# EasyEDA schematic digital clock no res.json
TITLE: Digital Clock Schematics; REV: 1.0; Date: 2021-03-11; Sheet: 1/1; Drawn By: QueenOfTheNorth; Company: Your Company
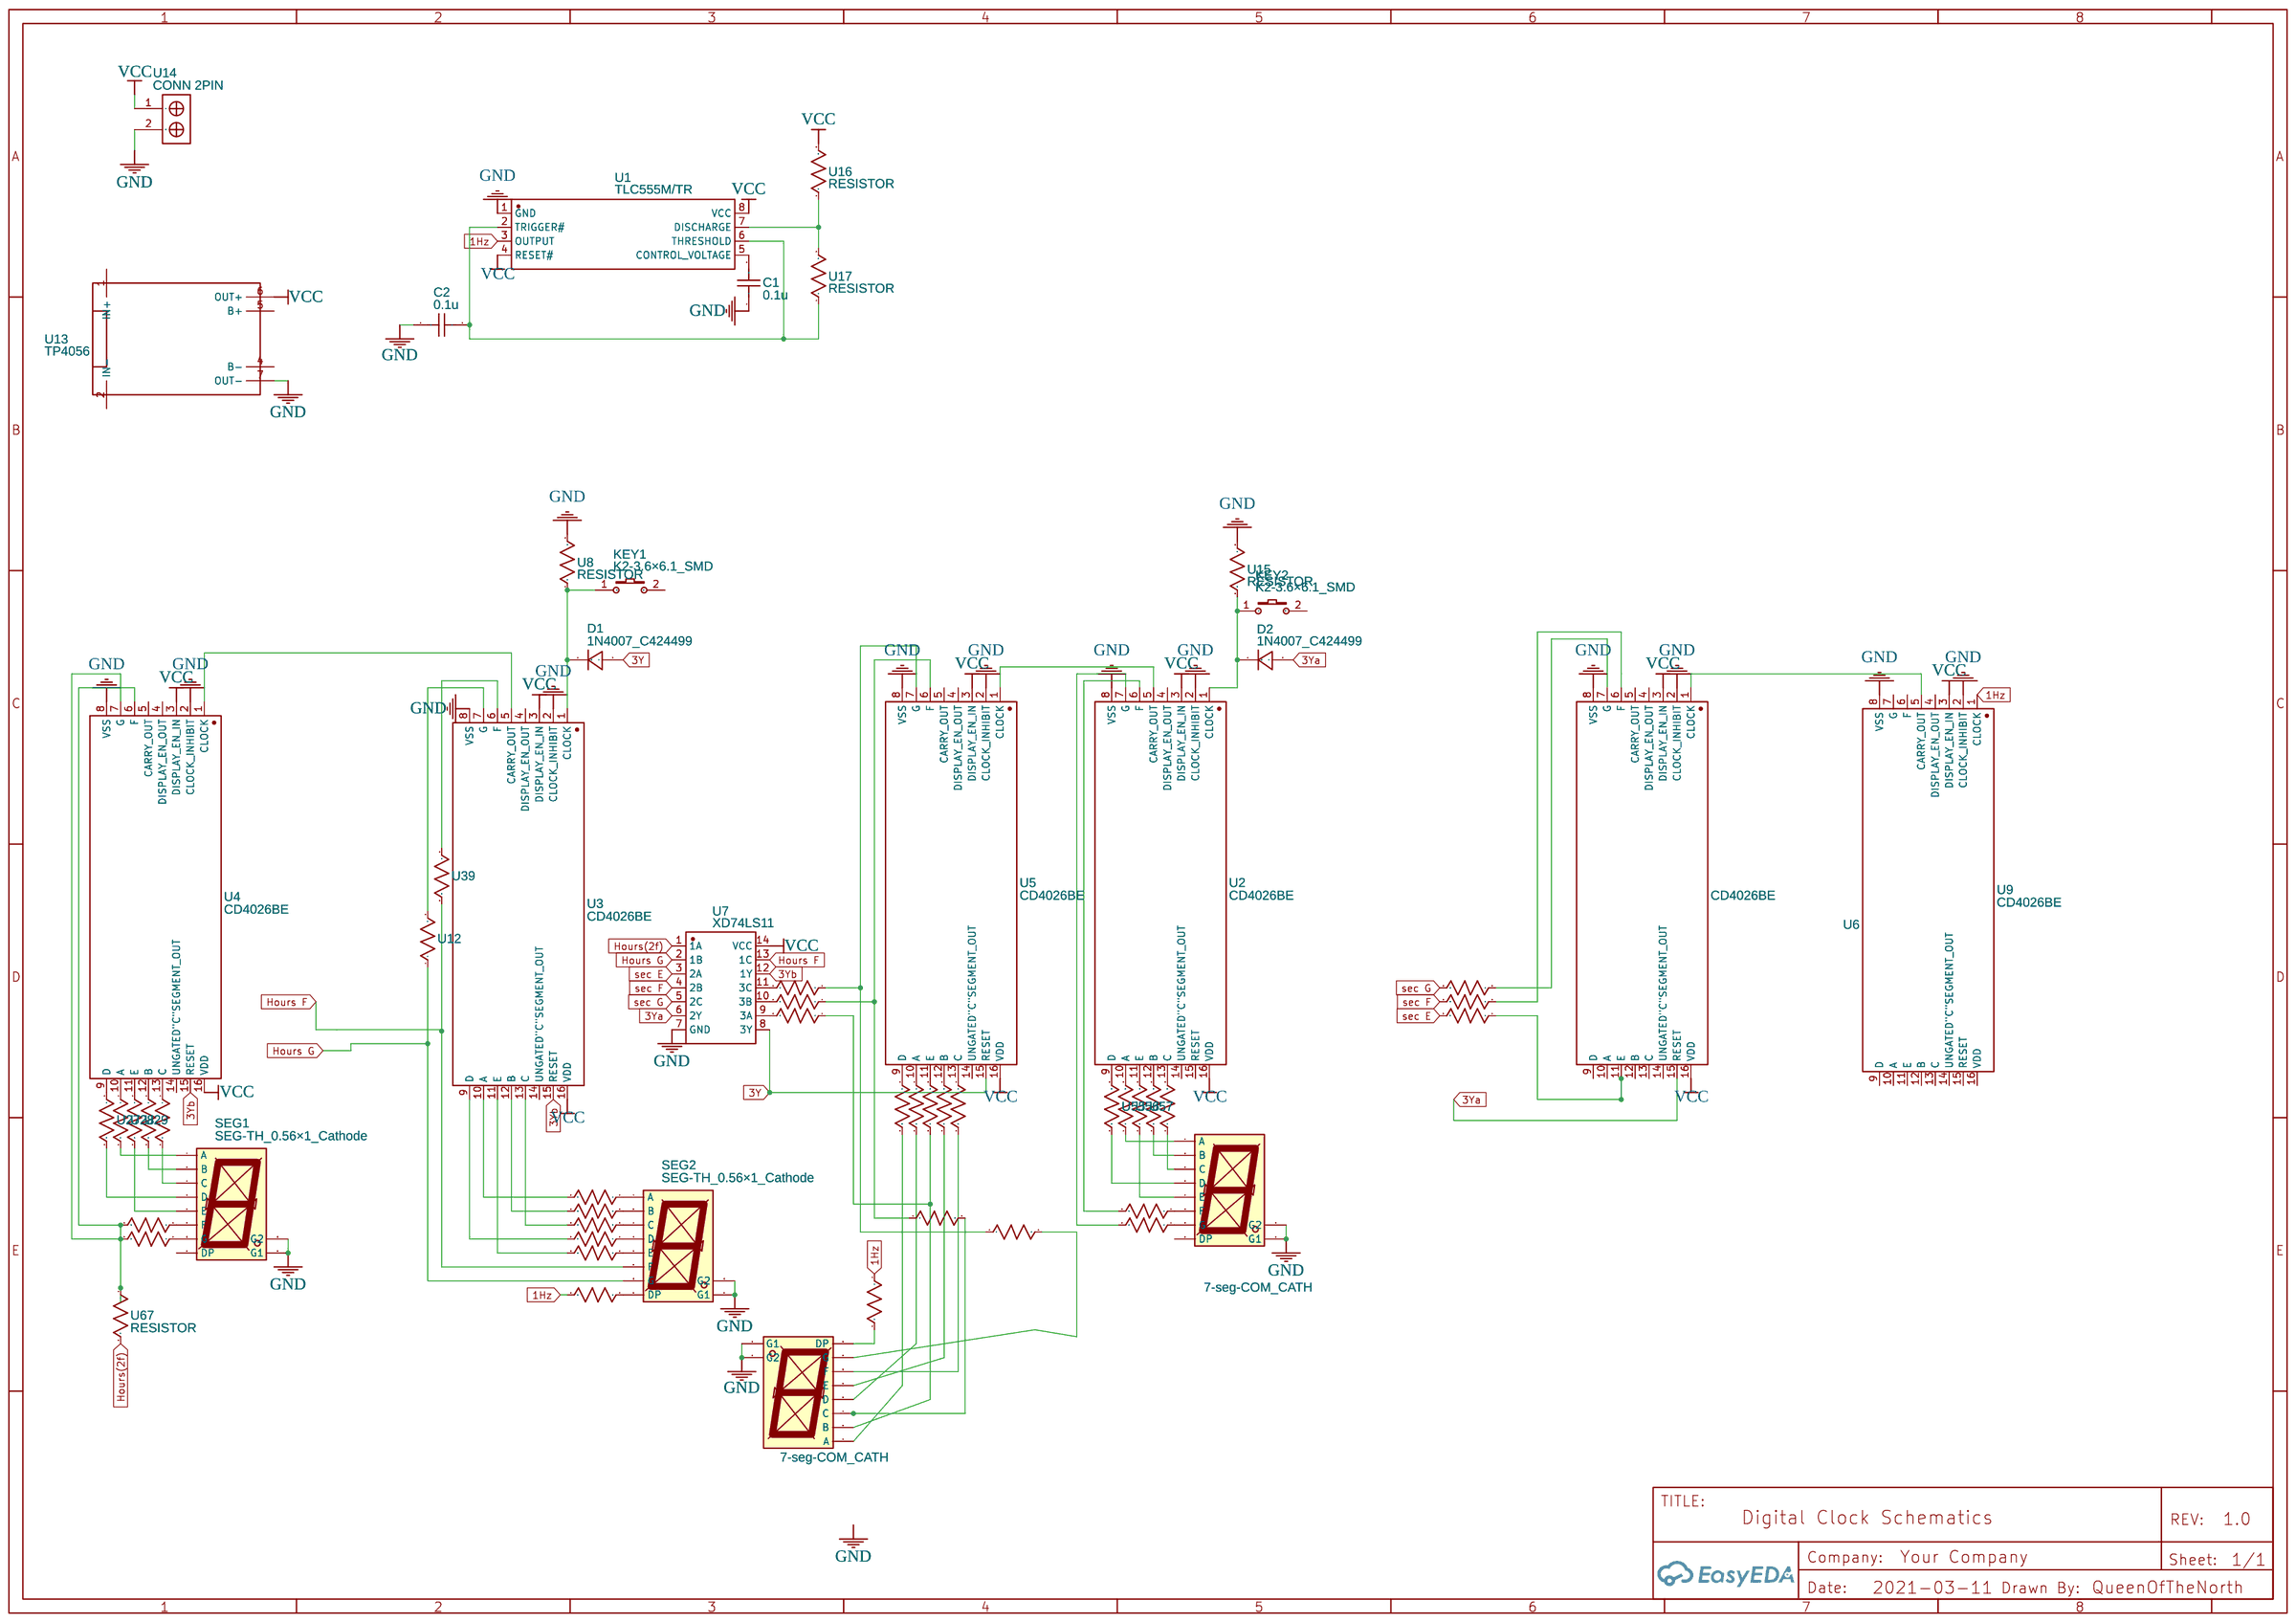
[diagram p0: schematic sheet]

## Parts
C1  0.1u  [C0603]
C2  0.1u  [C0603]
D1  1N4007_C424499  [DO-41_BD2.4-L4.7-P8.70-D0.9-RD]
D2  1N4007_C424499  [DO-41_BD2.4-L4.7-P8.70-D0.9-RD]
KEY1  K2-3.6×6.1_SMD  [KEY-SMD_2P-L6.2-W3.6-LS8.0]
KEY2  K2-3.6×6.1_SMD  [KEY-SMD_2P-L6.2-W3.6-LS8.0]
SEG1  SEG-TH_0.56×1_Cathode  [LED-SEG-TH_10P-L12.6-W19.0-P2.54-S15.24-BL]
SEG2  SEG-TH_0.56×1_Cathode  [LED-SEG-TH_10P-L12.6-W19.0-P2.54-S15.24-BL]
SEG3  7-seg-COM_CATH  [LED-SEG-TH_10P-L12.6-W19.0-P2.54-S15.24-BL]
SEG4  7-seg-COM_CATH  [LED-SEG-TH_10P-L12.6-W19.0-P2.54-S15.24-BL]
U1  TLC555M/TR  [SOP-8_L4.9-W3.9-P1.27-LS6.0-BL]
U2  CD4026BE  [DIP-16_L20.3-W10.2-P2.54-LS10.2-BL]
U3  CD4026BE  [DIP-16_L20.3-W10.2-P2.54-LS10.2-BL]
U4  CD4026BE  [DIP-16_L20.3-W10.2-P2.54-LS10.2-BL]
U5  CD4026BE  [DIP-16_L20.3-W10.2-P2.54-LS10.2-BL]
U6  CD4026BE  [DIP-16_L20.3-W10.2-P2.54-LS10.2-BL]
U7  XD74LS11  [DIP-14_L19.4-W6.4-P2.54-LS7.6-BL]
U8  RESISTOR  [0.4W 1% RESISTOR]
U9  CD4026BE  [DIP-16_L20.3-W10.2-P2.54-LS10.2-BL]
U10  RESISTOR  [0.4W 1% RESISTOR]
U11  RESISTOR  [0.4W 1% RESISTOR]
U12  RESISTOR  [0.4W 1% RESISTOR]
U13  TP4056  [TP4056-PROTECT]
U14  CONN 2PIN  [TERMINAL_BLOCK_KF762-3P]
U15  RESISTOR  [0.4W 1% RESISTOR]
U16  RESISTOR  [0.4W 1% RESISTOR]
U17  RESISTOR  [0.4W 1% RESISTOR]
U18  RESISTOR  [0.4W 1% RESISTOR]
U19  RESISTOR  [0.4W 1% RESISTOR]
U20  RESISTOR  [0.4W 1% RESISTOR]
U21  RESISTOR  [0.4W 1% RESISTOR]
U22  RESISTOR  [0.4W 1% RESISTOR]
U25  RESISTOR  [0.4W 1% RESISTOR]
U26  RESISTOR  [0.4W 1% RESISTOR]
U27  RESISTOR  [0.4W 1% RESISTOR]
U28  RESISTOR  [0.4W 1% RESISTOR]
U29  RESISTOR  [0.4W 1% RESISTOR]
U30  RESISTOR  [0.4W 1% RESISTOR]
U31  RESISTOR  [0.4W 1% RESISTOR]
U32  RESISTOR  [0.4W 1% RESISTOR]
U33  RESISTOR  [0.4W 1% RESISTOR]
U34  RESISTOR  [0.4W 1% RESISTOR]
U35  RESISTOR  [0.4W 1% RESISTOR]
U36  RESISTOR  [0.4W 1% RESISTOR]
U37  RESISTOR  [0.4W 1% RESISTOR]
U38  RESISTOR  [0.4W 1% RESISTOR]
U39  RESISTOR  [0.4W 1% RESISTOR]
U52  RESISTOR  [0.4W 1% RESISTOR]
U53  RESISTOR  [0.4W 1% RESISTOR]
U54  RESISTOR  [0.4W 1% RESISTOR]
U55  RESISTOR  [0.4W 1% RESISTOR]
U56  RESISTOR  [0.4W 1% RESISTOR]
U57  RESISTOR  [0.4W 1% RESISTOR]
U58  RESISTOR  [0.4W 1% RESISTOR]
U59  RESISTOR  [0.4W 1% RESISTOR]
U60  RESISTOR  [0.4W 1% RESISTOR]
U61  RESISTOR  [0.4W 1% RESISTOR]
U62  RESISTOR  [0.4W 1% RESISTOR]
U63  RESISTOR  [0.4W 1% RESISTOR]
U64  RESISTOR  [0.4W 1% RESISTOR]
U67  RESISTOR  [0.4W 1% RESISTOR]

## Library data of the parts
C1 C2 = C_0603_US: Contributor: LCEDA_Lib
D1 D2 = 1N4007_C424499: Supplier: LCSC; Supplier Part: C424499; Manufacturer: SUNMATE Elec; Manufacturer Part: 1N4007; Contributor: LCSC; LCSC Assembly: Yes; SMT Type: Extend; Assembly Type: manualWeld; Paste Type: expand
KEY1 KEY2 = K2-3.6×6.1_SMD: Supplier Part: C118141; Supplier: LCSC; Manufacturer Part: K2-1107ST-A4SW-06; Contributor: LCEDA_Lib; 制造商: 韩国韩荣
SEG1-SEG4 = SEG-TH_0.56×1_Cathode: Manufacturer: 志浩; Supplier Part: C8093; Contributor: LCEDA_01
U1 = TLC555M/TR: Supplier: LCSC; Supplier Part: C383061; Manufacturer: HGSEMI; Contributor: LCSC; Assembly Type: smtWeld; Paste Type: expand
U2-U6 U9 = CD4026BE: Supplier: LCSC; Manufacturer: TI; Supplier Part: C89909; LCSC Assembly: Yes; SMT Type: Extend; Assembly Type: manualWeld; Paste Type: expand
U7 = XD74LS11: Supplier: LCSC; Supplier Part: C521167; Manufacturer: XINLUDA(信路达); Contributor: LCSC
U8 U10-U12 U15-U22 U25-U39 U52-U64 U67 = RESISTOR: Contributor: dannyjacket
U13 = TP4056: Manufacturer Part: TP4056-protect; link: https://dlnmh9ip6v2uc.cloudfront.net/datasheets/Prototyping/TP4056.pdf; Contributor: quocanhhai
U14 = CONN 2PIN: Manufacturer Part: Terminal Block; Supplier Part: undefined; Contributor: bangnaga

## Nets
GND: C1.1 C2.1 SEG1.3(G1) SEG1.8(G2) SEG2.3(G1) SEG2.8(G2) SEG3.3(G1) SEG3.8(G2) SEG4.3(G1) SEG4.8(G2) U1.1(GND) U2.2(CLOCK_INHIBIT) U2.8(VSS) U3.2(CLOCK_INHIBIT) U3.8(VSS) U4.2(CLOCK_INHIBIT) U4.8(VSS) U5.2(CLOCK_INHIBIT) U5.8(VSS) U6.2(CLOCK_INHIBIT) U6.8(VSS) U7.7(GND) U8.2 U9.2(CLOCK_INHIBIT) U9.8(VSS) U13.7(OUT-) U14.2 U15.2
VCC: U1.4(RESET#) U1.8(VCC) U2.3(DISPLAY_EN_IN) U2.16(VDD) U3.3(DISPLAY_EN_IN) U3.16(VDD) U4.3(DISPLAY_EN_IN) U4.16(VDD) U5.3(DISPLAY_EN_IN) U5.16(VDD) U6.3(DISPLAY_EN_IN) U6.16(VDD) U7.14(VCC) U9.3(DISPLAY_EN_IN) U13.6(OUT+) U14.1 U16.2
1Hz: U1.3(OUTPUT) U9.1(CLOCK) U10.1 U11.2
3Y: D1.2(A) U5.15(RESET) U7.8(3Y)
3Ya: D2.2(A) U6.15(RESET) U7.6(2Y)
3Yb: U3.15(RESET) U4.15(RESET) U7.12(1Y)
Hours F: SEG2.9(F) U7.13(1C) U39.1
Hours G: SEG2.10(G) U7.2(1B) U12.1
Hours(2f): U7.1(1A) U67.2
sec E: U7.3(2A) U52.2
sec F: U7.4(2B) U53.2
sec G: U7.5(2C) U54.2
Net-(C1-2): C1.2 U1.5(CONTROL VOLTAGE)
Net-(C2-2): C2.2 U1.2(TRIGGER#) U1.6(THRESHOLD) U17.1
Net-(D1-1): D1.1(C) KEY1.1 U3.1(CLOCK) U8.1
Net-(D2-1): D2.1(C) KEY2.1 U2.1(CLOCK) U15.1
Net-(SEG1-1): SEG1.1(E) U29.2
Net-(SEG1-2): SEG1.2(D) U27.2
Net-(SEG1-4): SEG1.4(C) U31.2
Net-(SEG1-6): SEG1.6(B) U30.2
Net-(SEG1-7): SEG1.7(A) U28.2
Net-(SEG1-9): SEG1.9(F) U26.1
Net-(SEG1-10): SEG1.10(G) U25.1
Net-(SEG2-1): SEG2.1(E) U22.1
Net-(SEG2-2): SEG2.2(D) U21.1
Net-(SEG2-4): SEG2.4(C) U20.1
Net-(SEG2-5): SEG2.5(DP) U11.1
Net-(SEG2-6): SEG2.6(B) U19.1
Net-(SEG2-7): SEG2.7(A) U18.1
Net-(SEG3-1): SEG3.1(E) U33.2
Net-(SEG3-2): SEG3.2(D) U35.2
Net-(SEG3-4): SEG3.4(C) U37.2
Net-(SEG3-5): SEG3.5(DP) U10.2
Net-(SEG3-6): SEG3.6(B) U34.2 U64.1
Net-(SEG3-7): SEG3.7(A) U36.2
Net-(SEG3-9): SEG3.9(F) U32.2
Net-(SEG3-10): SEG3.10(G) U38.2
Net-(SEG4-1): SEG4.1(E) U57.1
Net-(SEG4-2): SEG4.2(D) U55.1
Net-(SEG4-4): SEG4.4(C) U59.1
Net-(SEG4-6): SEG4.6(B) U58.1
Net-(SEG4-7): SEG4.7(A) U56.1
Net-(SEG4-9): SEG4.9(F) U61.1
Net-(SEG4-10): SEG4.10(G) U60.1
Net-(U1-7): U1.7(DISCHARGE) U16.1 U17.2
Net-(U2-5): U2.5(CARRY_OUT) U5.1(CLOCK)
Net-(U2-6): U2.6(F) U61.2
Net-(U2-7): U2.7(G) U60.2
Net-(U2-9): U2.9(D) U55.2
Net-(U2-10): U2.10(A) U56.2
Net-(U2-11): U2.11(E) U57.2
Net-(U2-12): U2.12(B) U58.2
Net-(U2-13): U2.13(C) U59.2
Net-(U3-5): U3.5(CARRY_OUT) U4.1(CLOCK)
Net-(U3-6): U3.6(F) U39.2
Net-(U3-7): U3.7(G) U12.2
Net-(U3-9): U3.9(D) U21.2
Net-(U3-10): U3.10(A) U18.2
Net-(U3-11): U3.11(E) U22.2
Net-(U3-12): U3.12(B) U19.2
Net-(U3-13): U3.13(C) U20.2
Net-(U4-6): U4.6(F) U4.7(G) U25.2 U26.2 U67.1
Net-(U4-9): U4.9(D) U27.1
Net-(U4-10): U4.10(A) U28.1
Net-(U4-11): U4.11(E) U29.1
Net-(U4-12): U4.12(B) U30.1
Net-(U4-13): U4.13(C) U31.1
Net-(U5-6): U5.6(F) U37.1 U63.1
Net-(U5-7): U5.7(G) U38.1 U62.1
Net-(U5-9): U5.9(D) U36.1
Net-(U5-10): U5.10(A) U35.1
Net-(U5-11): U5.11(E) U34.1
Net-(U5-12): U5.12(B) U33.1
Net-(U5-13): U5.13(C) U32.1
Net-(U6-1): U6.1(CLOCK) U9.5(CARRY_OUT)
Net-(U6-6): U6.6(F) U53.1
Net-(U6-7): U6.7(G) U54.1
Net-(U6-11): U6.11(E) U52.1
Net-(U7-9): U7.9(3A) U64.2
Net-(U7-10): U7.10(3B) U63.2
Net-(U7-11): U7.11(3C) U62.2

Not connected (* = marked no-connect by the designer): KEY1 2; KEY2 2; SEG1 5(DP); SEG4 5(DP); U2 4(DISPLAY_EN_OUT) 14(UNGATED"C"SEGMENT_OUT) 15(RESET); U3 4(DISPLAY_EN_OUT) 14(UNGATED"C"SEGMENT_OUT); U4 4(DISPLAY_EN_OUT) 5(CARRY_OUT) 14(UNGATED"C"SEGMENT_OUT); U5 4(DISPLAY_EN_OUT) 5(CARRY_OUT) 14(UNGATED"C"SEGMENT_OUT); U6 4(DISPLAY_EN_OUT) 5(CARRY_OUT) 9(D) 10(A) 12(B) 13(C) 14(UNGATED"C"SEGMENT_OUT); U9 4(DISPLAY_EN_OUT) 6(F) 7(G) 9(D) 10(A) 11(E) 12(B) 13(C) 14(UNGATED"C"SEGMENT_OUT) 15(RESET) 16(VDD); U13 1(IN+) 2(IN-) 4(B-) 5(B+)
